# EAGLE design 8_Channel_Current_Sensor (EAGLE 9.0.0)
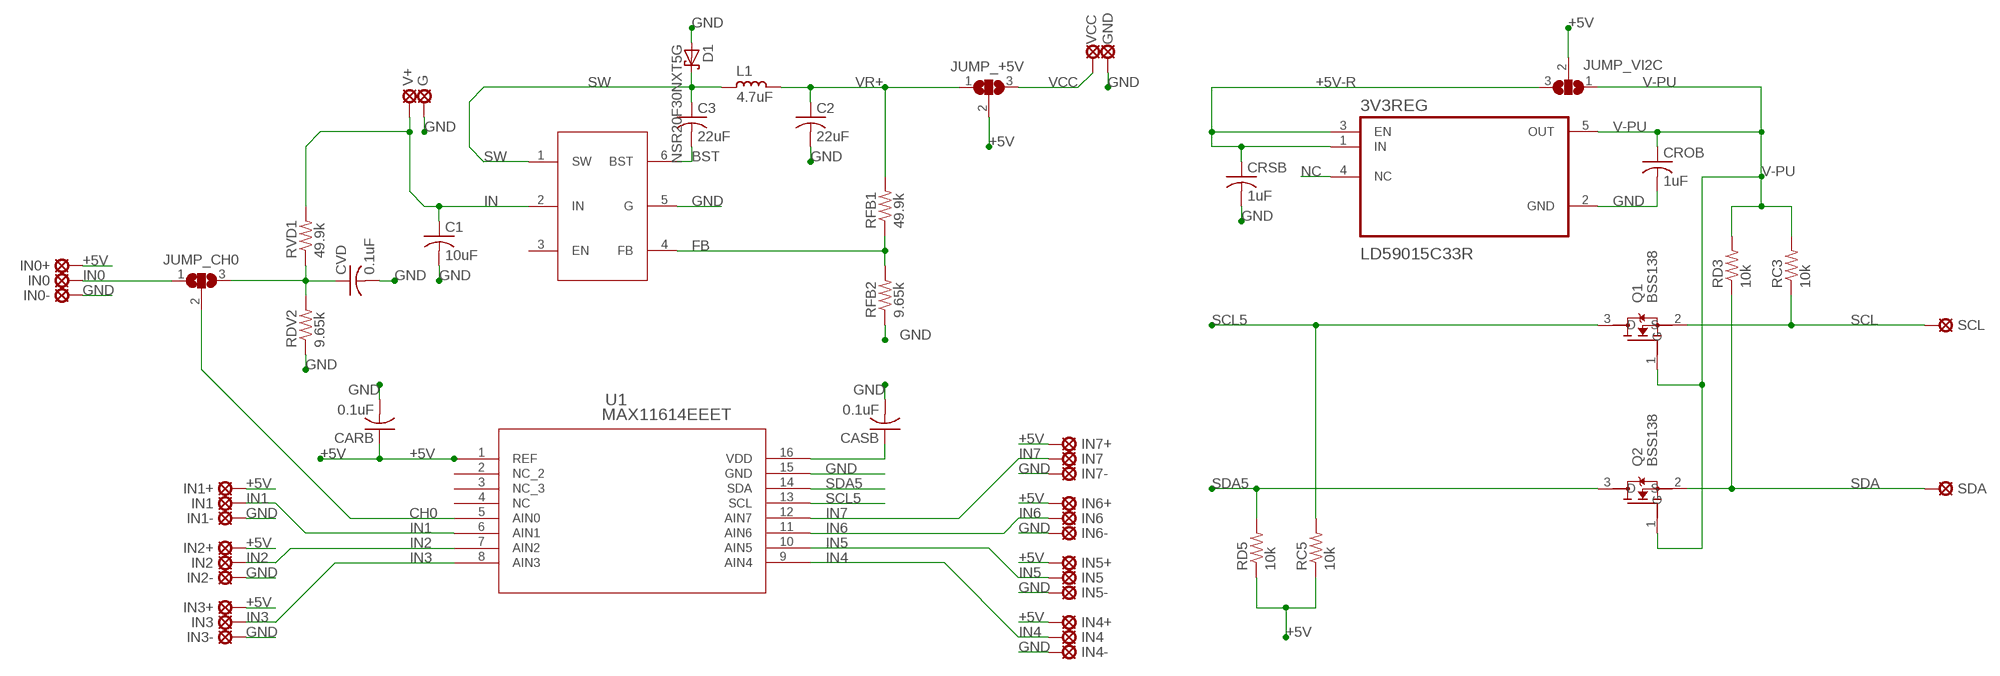
[diagram p0: schematic, sheet 1]

## Parts
3V3REG  LD59015C33R  [SOT65P210X110-5N]
5VBUCK  ACT4088US-T  [SOT236]
C1  10uF  C-USC0603K  [C0603K]
C2  22uF  C-USC0603K  [C0603K]
C3  22uF  C-USC0603K  [C0603K]
CARB  0.1uF  C-USC0603  [C0603]
CASB  0.1uF  C-USC0603  [C0603]
CROB  1uF  C-USC0603  [C0603]
CRSB  1uF  C-USC0603  [C0603]
CVD  0.1uF  C-USC0603K  [C0603K]
D1  NSR20F30NXT5G  [C0603K]
G  LSP10  [LSP10]
GND  LSP10  [LSP10]
IN0  LSP10  [LSP10]
IN0+  LSP10  [LSP10]
IN0-  LSP10  [LSP10]
IN1  LSP10  [LSP10]
IN1+  LSP10  [LSP10]
IN1-  LSP10  [LSP10]
IN2  LSP10  [LSP10]
IN2+  LSP10  [LSP10]
IN2-  LSP10  [LSP10]
IN3  LSP10  [LSP10]
IN3+  LSP10  [LSP10]
IN3-  LSP10  [LSP10]
IN4  LSP10  [LSP10]
IN4+  LSP10  [LSP10]
IN4-  LSP10  [LSP10]
IN5  LSP10  [LSP10]
IN5+  LSP10  [LSP10]
IN5-  LSP10  [LSP10]
IN6  LSP10  [LSP10]
IN6+  LSP10  [LSP10]
IN6-  LSP10  [LSP10]
IN7  LSP10  [LSP10]
IN7+  LSP10  [LSP10]
IN7-  LSP10  [LSP10]
JUMP_+5V  SJ2W  [SJ_2]
JUMP_CH0  SJ2W  [SJ_2]
JUMP_VI2C  SJ2W  [SJ_2]
L1  4.7uF  L_PM1008  [PM1008]
Q1  BSS138  [SOT95P240X120-3N]
Q2  BSS138  [SOT95P240X120-3N]
RC3  10k  R-US_R0603  [R0603]
RC5  10k  R-US_R0603  [R0603]
RD3  10k  R-US_R0603  [R0603]
RD5  10k  R-US_R0603  [R0603]
RDV2  9.65k  R-US_R0603  [R0603]
RFB1  49.9k  R-US_R0603  [R0603]
RFB2  9.65k  R-US_R0603  [R0603]
RVD1  49.9k  R-US_R0603  [R0603]
SCL  LSP10  [LSP10]
SDA  LSP10  [LSP10]
U1  MAX11614EEET  [21-0055H_16]
V+  LSP10  [LSP10]
VCC  LSP10  [LSP10]

## Nets
+5V: CARB.1 CASB.1 IN0+.MP IN1+.MP IN2+.MP IN3+.MP IN4+.MP IN5+.MP IN6+.MP IN7+.MP JUMP_+5V.2 JUMP_VI2C.2 RC5.1 RD5.1 U1.1(REF) U1.16(VDD)
+5V-R: 3V3REG.1(IN) 3V3REG.3(EN) CRSB.1 JUMP_VI2C.3
BST: 5VBUCK.6(BST) C3.2
CH0: JUMP_CH0.2 U1.5(AIN0)
FB: 5VBUCK.4(FB) RFB1.1 RFB2.2
GND: 3V3REG.2(GND) 5VBUCK.5(G) C1.2 C2.2 CARB.2 CASB.2 CROB.2 CRSB.2 CVD.2 D1.1(A) G.MP GND.MP IN0-.MP IN1-.MP IN2-.MP IN3-.MP IN4-.MP IN5-.MP IN6-.MP IN7-.MP RDV2.1 RFB2.1 U1.15(GND)
IN: 5VBUCK.2(IN) C1.1 RVD1.2 V+.MP
IN0: IN0.MP JUMP_CH0.1
IN1: IN1.MP U1.6(AIN1)
IN2: IN2.MP U1.7(AIN2)
IN3: IN3.MP U1.8(AIN3)
IN4: IN4.MP U1.9(AIN4)
IN5: IN5.MP U1.10(AIN5)
IN6: IN6.MP U1.11(AIN6)
IN7: IN7.MP U1.12(AIN7)
NC: 3V3REG.4(NC)
SCL: Q1.2(S) RC3.1 SCL.MP
SCL5: Q1.3(D) RC5.2 U1.13(SCL)
SDA: Q2.2(S) RD3.1 SDA.MP
SDA5: Q2.3(D) RD5.2 U1.14(SDA)
SW: 5VBUCK.1(SW) C3.1 D1.2(C) L1.2
V-PU: 3V3REG.5(OUT) CROB.1 JUMP_VI2C.1 Q1.1(G) Q2.1(G) RC3.2 RD3.2
VCC: JUMP_+5V.3 VCC.MP
VD: CVD.1 JUMP_CH0.3 RDV2.2 RVD1.1
VR+: C2.1 JUMP_+5V.1 L1.1 RFB1.2
Unconnected: 5VBUCK.3(EN) U1.2(NC_2) U1.3(NC_3) U1.4(NC)

## Library data of the parts
3V3REG = LD59015C33R:LD59015C33R: None; AVAILABILITY: Good; DESCRIPTION: LD59015 Series 150 mA 3.3 V Fixed High PSRR LDO Voltage Regulator - SOT-323-5; MF: STMicroelectronics; MP: LD59015C33R; PACKAGE: SOT-323 STMicroelectronics; PRICE: 0.44 USD
5VBUCK = ACT4088US-T:ACT4088US-T
C1-C3 CARB CASB CROB CRSB CVD = resistor:C-US: CAPACITOR, American symbol
D1 = NSR20F30NXT5G:NSR20F30NXT5G
G GND IN0 IN0+ IN0- IN1 IN1+ IN1- IN2 IN2+ IN2- IN3 IN3+ IN3- IN4 IN4+ IN4- IN5 IN5+ IN5- IN6 IN6+ IN6- IN7 IN7+ IN7- SCL SDA V+ VCC = solpad:LSP10: SOLDER PAD drill 1.0 mm, distributor Buerklin, 12H555
JUMP_+5V JUMP_CH0 JUMP_VI2C = jumper:SJ2W: SMD solder JUMPER
L1 = rc-master-smd:L_: INDUCTOR
Q1 Q2 = BSS138:BSS138: B138 Series 50 V 6 Ohms N-Ch Logic Level Enhancement Mode FET - SOT-23-3; AVAILABILITY: Good; DESCRIPTION: 50V N-Channel Logic Level Enhancement Mode Field Effect Transistor; MF: ON Semiconductor; MP: BSS138; PACKAGE: SOT-23 ON Semiconductor; PRICE: 0.09 USD
RC3 RC5 RD3 RD5 RDV2 RFB1 RFB2 RVD1 = resistor:R-US_: RESISTOR, American symbol
U1 = MAX11614EEET:MAX11614EEET; AVAILABILITY: Warning; DESCRIPTION: Analog To Digital Converter Adc, 12 Bit, 94.4ksps, Qsop-16; MF: Maxim Integrated; MP: MAX11614EEE+; PACKAGE: QSOP-16 Maxim Integrated; PRICE: 3.41 USD

## Board
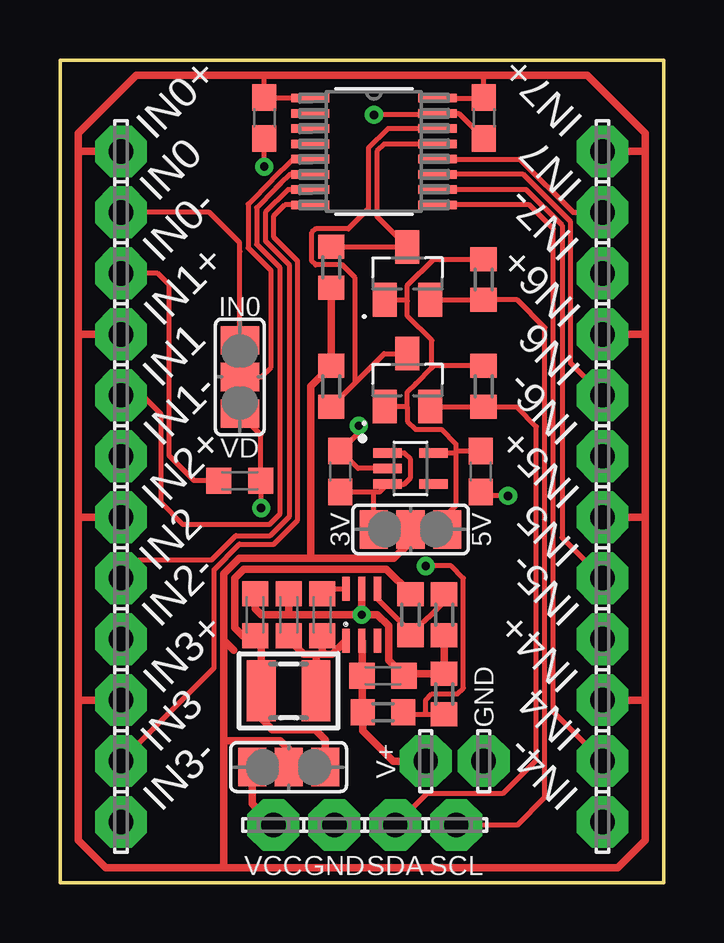
[diagram p1: board, top side]
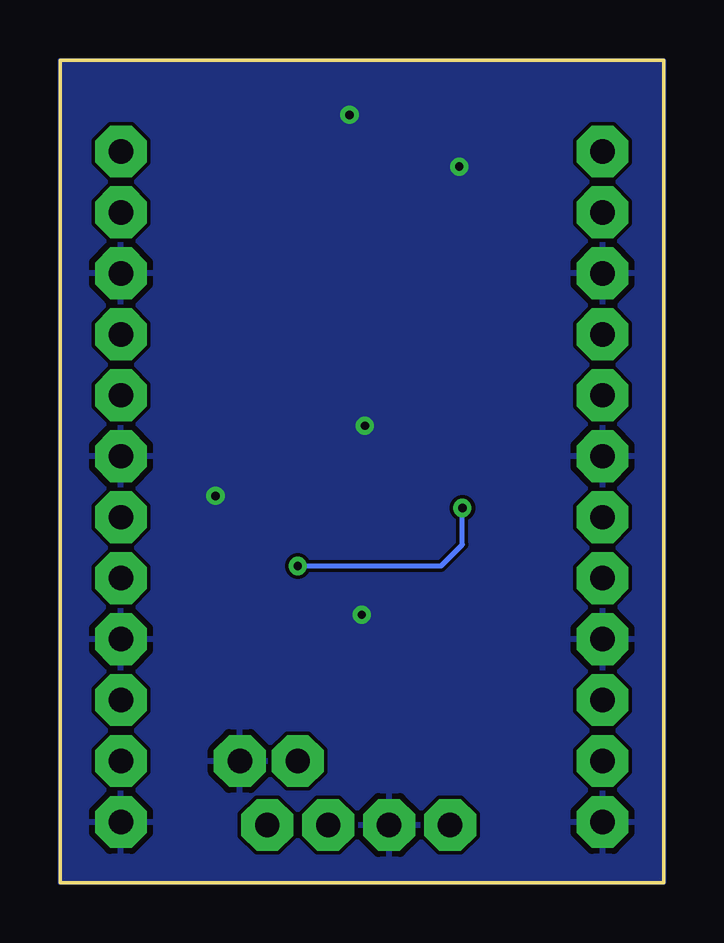
[diagram p2: board, bottom side, seen from below]

Size 25.15 x 34.29 mm. Coordinates in mm from the lower left corner, seen from the top.
Outline: 0,0 0,34.29 25.15,34.29 25.15,0 0,0
Copper layers (1*16): Top 0.035mm / dielectric 1.5mm / Bottom 0.035mm
Design rules "default *": minimum track width 6mil, minimum drill 0.35mm, track to track 6mil, track to pad 6mil, pad to pad 6mil, via to via 6mil, smd to smd 6mil, copper to edge 0mil, drill to drill 6mil, minimum pad ring 10mil, minimum via ring 8mil, stop-mask expansion 4mil, vias tented up to drill 0mil, thermal gap 10mil

### Footprints (pad centres in the part's own frame; a part is rotated, then mirrored left to right if it is on the bottom)
SOT65P210X110-5N = smd 0.4 x 1.19: 1 -0.65,-0.96; 2 0,-0.96; 3 0.65,-0.96; 4 0.65,0.96; 5 -0.65,0.96
SOT236 = smd 0.3 x 1: 1 -0.66,-1.09; 2 0,-1.09; 3 0.66,-1.09; 4 0.66,1.09; 5 0,1.09; 6 -0.66,1.09
C0603K = smd 1.05 x 1.08: 1 -0.875,0; 2 0.875,0
C0603 = smd 1.1 x 1: 1 -0.85,0; 2 0.85,0
LSP10 = drill 1.016 pad 2.159 octagon: MP 0,0
SJ_2 = smd 1.168 x 1.6: 1 -1.524,0; 2 0,0; 3 1.524,0
PM1008 = smd 1.2 x 2.54: 1 -1.143,0; 2 1.143,0
SOT95P240X120-3N = smd 1 x 1.4: 1 -0.95,-1.1; 2 0.95,-1.1; 3 0,1.1
R0603 = smd 1 x 1.1: 1 -0.85,0; 2 0.85,0
21-0055H_16 = smd 1.6 x 0.356: 1 -2.654,2.223; 2 -2.654,1.587; 3 -2.654,0.953; 4 -2.654,0.318; 5 -2.654,-0.318; 6 -2.654,-0.953; 7 -2.654,-1.587; 8 -2.654,-2.223; 9 2.654,-2.223; 10 2.654,-1.587; 11 2.654,-0.953; 12 2.654,-0.318; 13 2.654,0.318; 14 2.654,0.953; 15 2.654,1.587; 16 2.654,2.223

### Placement (x,y rotation side)
3V3REG  14.61,17.27 270 top
5VBUCK  12.57,11.18 0 top
C1  13.46,8.64 0 top
C2  8.13,11.18 90 top
C3  10.92,11.18 90 top
CARB  8.51,31.88 270 top
CASB  17.65,31.88 270 top
CROB  17.53,17.14 270 top
CRSB  11.68,17.14 90 top
CVD  7.49,16.76 180 top
D1  9.53,11.18 270 top
G  17.65,5.08 90 top
GND  11.43,2.41 0 top
IN0  2.54,27.94 90 top
IN0+  2.54,30.48 90 top
IN0-  2.54,25.4 90 top
IN1  2.54,20.32 90 top
IN1+  2.54,22.86 90 top
IN1-  2.54,17.78 90 top
IN2  2.54,12.7 90 top
IN2+  2.54,15.24 90 top
IN2-  2.54,10.16 90 top
IN3  2.54,5.08 90 top
IN3+  2.54,7.62 90 top
IN3-  2.54,2.54 90 top
IN4  22.61,5.08 270 top
IN4+  22.61,7.62 270 top
IN4-  22.61,2.54 270 top
IN5  22.61,12.7 270 top
IN5+  22.61,15.24 270 top
IN5-  22.61,10.16 270 top
IN6  22.61,20.32 270 top
IN6+  22.61,22.86 270 top
IN6-  22.61,17.78 270 top
IN7  22.61,27.94 270 top
IN7+  22.61,30.48 270 top
IN7-  22.61,25.4 270 top
JUMP_+5V  9.53,4.83 180 top
JUMP_CH0  7.49,21.08 270 top
JUMP_VI2C  14.61,14.73 180 top
L1  9.53,8 0 top
Q1  14.48,25.4 0 top
Q2  14.48,20.95 0 top
RC3  17.65,25.15 90 top
RC5  11.3,25.65 90 top
RD3  17.65,20.7 90 top
RD5  11.3,20.7 270 top
RDV2  16,7.87 270 top
RFB1  14.61,11.18 90 top
RFB2  16,11.18 90 top
RVD1  13.46,7.11 180 top
SCL  16.51,2.41 0 top
SDA  13.97,2.41 0 top
U1  13.08,30.48 0 top
V+  15.24,5.08 90 top
VCC  8.89,2.41 0 top

### Tracks (layer width: path | path; a pad name or v marks a point on that pad's centre or on a via)
+5V
  Top 0.203: U1.1 8.53,32.7 CARB.1 8.51,33.66 | U1.16 17.55,32.7 CASB.1 17.65,33.66
  Top 0.305: 0.76,7.62 0.76,1.78 1.91,0.64 6.86,0.64 | 0.76,7.62 0.76,15.24 | 0.76,15.24 0.76,22.86 | IN1+.MP 0.76,22.86 | IN2+.MP 0.76,15.24 | IN3+.MP 0.76,7.62 | 6.86,0.64 23.24,0.64 24.38,1.78 24.38,7.62 | 24.38,7.62 24.38,15.24 | 24.38,15.24 24.38,22.86 | 24.38,22.86 24.38,30.48 | IN7+.MP 24.38,30.48 | IN6+.MP 24.38,22.86 | IN5+.MP 24.38,15.24 | IN4+.MP 24.38,7.62 | U1.1 10.4,32.73 | 0.76,22.86 0.76,30.48 | 0.76,30.48 0.76,31.24 3.17,33.66 8.51,33.66 17.65,33.66 21.97,33.66 24.38,31.24 24.38,30.48 | RC5.1 RD5.1 10.45,20.7 10.45,13.56 10.41,13.53 | IN0+.MP 0.76,30.48 | 6.83,10.11 6.83,12.89 7.46,13.53 10.41,13.53 | 7.24,9.69 6.83,10.11 | JUMP_VI2C.2 14.61,14.22 13.91,13.53 10.41,13.53 | 6.83,10.11 6.83,5.97 | 6.83,5.97 6.83,0.67 6.86,0.64 | JUMP_+5V.2 9.53,5.59 9.18,5.93 6.86,5.93 6.83,5.97
+5V-R
  Top 0.203: CRSB.1 13.08,16.3 | 13.08,16.3 13.32,16.3 3V3REG.3 14.34,16.62 14.61,16.89 14.61,17.65 14.35,17.91 13.66,17.91 3V3REG.1 | JUMP_VI2C.3 13.08,16.3
BST
  Top 0.203: C3.2 11.14,12.27 5VBUCK.6
CH0
  Top 0.203: U1.5 9.72,30.16 8.83,29.27 | 8.83,29.27 | 8.83,29.27 7.84,28.28 7.84,26.46 8.79,25.51 8.79,21.49 8.38,21.08 JUMP_CH0.2
FB
  Top 0.203: 5VBUCK.4 13.23,11.81 14.61,10.44 RFB1.1 15.2,10.92 15.2,10.93 15.35,11.08 15.36,11.08 16,11.72 RFB2.2
GND  (via drill 0.35)
  Top 0.203: v13.08,32 15.73,32 U1.15 16.61,32.07 CASB.2 | 3V3REG.2 12.41,17.27 CRSB.2 12.45,18.76 v12.45,19.05 | v8.51,29.84 CARB.2 | CROB.2 17.69,16.13 v18.67,16.13 | CVD.2 5.59,16.76 4.55,17.8 4.55,24.92 4.06,25.4 IN0-.MP
  Top 0.305: C2.2 8.13,11.43 8.38,11.18 9.53,11.18 | v12.57,11.18 13.22,11.18 13.69,10.71 13.69,9.29 C1.2 14.43,8.72 RDV2.1 RFB2.1 | v12.57,11.18 9.53,11.18 | D1.1 9.53,11.18 | v12.57,11.18 5VBUCK.5
  pour Bottom: 0,34.29 0,0 25.15,0 25.15,34.29
IN
  Top 0.305: 5VBUCK.2 12.59,10.07 C1.1 12.59,7.14 RVD1.2 12.61,6.35 13.88,5.08 V+.MP
IN0
  Top 0.203: IN0.MP 6.22,27.94 7.49,26.68 7.49,26.32 7.49,26.31 JUMP_CH0.1
IN1
  Top 0.203: IN1.MP 3.43,20.32 4.19,19.56 4.19,15.88 5.13,14.94 8.72,14.94 9.15,15.36 9.15,25.66 8.2,26.61 8.2,28.14 8.98,28.91 | 9.19,29.12 9.59,29.53 U1.6 | 9.19,29.12 | 9.19,29.12 8.98,28.91 | 8.98,28.91
IN2
  Top 0.203: IN2.MP 3.3,13.46 6.32,13.46 7.33,14.47 | U1.7 9.5,28.89 8.55,27.94 8.55,26.76 9.55,25.76 9.55,15.26 8.76,14.47 7.33,14.47 | 7.33,14.47
IN3
  Top 0.203: U1.8 9.37,28.26 8.91,27.8 8.91,26.91 9.91,25.91 9.91,15.11 8.91,14.12 7.47,14.12 6.42,13.06 6.42,8.96 IN3.MP
IN4
  Top 0.203: U1.9 19.56,28.26 20.56,27.25 20.56,7.12 IN4.MP
IN5
  Top 0.203: IN5.MP 20.92,14.39 20.92,27.4 19.43,28.89 U1.10
IN6
  Top 0.203: IN6.MP 21.27,21.65 21.27,27.55 19.29,29.53 U1.11
IN7
  Top 0.203: U1.12 19.16,30.16 21.38,27.94 IN7.MP
SCL
  Top 0.203: Q1.2 RC3.1 19.05,24.3 20.21,23.14 20.21,3.57 19.05,2.41 SCL.MP
SCL5
  Top 0.203: RC5.2 Q1.3 13.21,27.77 13.21,30.48 13.53,30.8 U1.13
SDA
  Top 0.203: Q2.2 RD3.1 17.69,19.81 19.05,19.81 19.85,19.01 19.85,5.12 18.48,3.75 15.3,3.75 SDA.MP
SDA5
  Top 0.203: RD5.2 12.3,20.85 | 12.3,20.85 13.51,22.05 Q2.3 | 12.3,20.85 12.3,25.22 11.77,25.75 10.65,25.75 10.5,25.9 10.5,27.11 10.65,27.26 12.02,27.26 12.85,28.09 12.85,30.63 13.66,31.43 U1.14
SW
  Top 0.203: C3.1 11.14,10.09
  Top 0.305: 5VBUCK.1 11.35,9.53 10.92,9.53 | D1.2 9.53,10.16 10.16,9.53 10.67,9.53 | 10.92,9.53 10.67,9.53 | C3.1 10.92,9.53 | L1.2 10.67,9.53
V-PU
  Top 0.203: JUMP_VI2C.1 16.13,15.37 16.51,15.75 16.51,16.98 | 15.49,21.46 14.84,20.81 14.82,20.81 14.48,20.46 14.48,19.81 | 15.49,21.46 15.49,22.61 14.48,23.62 14.48,24.26 | 14.48,24.26 14.48,24.91 15.56,26 RC3.2 | Q1.1 14.44,24.3 14.48,24.26 | RD3.2 15.58,21.55 15.49,21.46 | Q2.1 14.44,19.86 14.48,19.81 | 16.51,16.98 | 15.58,17.91 3V3REG.5 16.5,17.92 16.51,17.91 | 16.51,16.98 16.51,17.91 | 16.51,17.91 16.51,18.03 | 16.51,18.03 16.51,18.29 15.9,18.9 14.82,18.9 14.48,19.25 14.48,19.81 | CROB.1 16.55,18 16.51,18.03
VCC
  Top 0.305: JUMP_+5V.3 8,3.3 VCC.MP
VD  (via drill 0.35)
  Top 0.203: RVD1.1 14.4,7.02 15.24,7.02 | 15.24,7.02 RDV2.2 | 15.24,7.02 15.24,7.62 15.49,7.87 16.56,7.87 16.81,8.12 16.81,12.7 16.3,13.21 v15.24,13.21 | JUMP_CH0.3 8.37,18.68 CVD.1 8.38,16.75 v8.38,15.62
  Bottom 0.203: v15.24,13.21 9.27,13.21 8.38,14.1 v8.38,15.62
VR+
  Top 0.305: RFB1.2 14.61,12.06 13.6,13.07 7.65,13.07 7.28,12.7 7.28,10.64 7.62,10.3 C2.1 8.38,10.05 L1.1 8.38,6.86 8.85,6.39 10.63,6.39 11.05,5.97 JUMP_+5V.1

### Text on the board
tNames: IN0 | VD | 3V | 5V | GND | VCC | GND | SDA | SCL
tValues: VCC | VR+